# Altium schematic sheet ArduinoV1Sch.SchDoc (part 3 of 3)
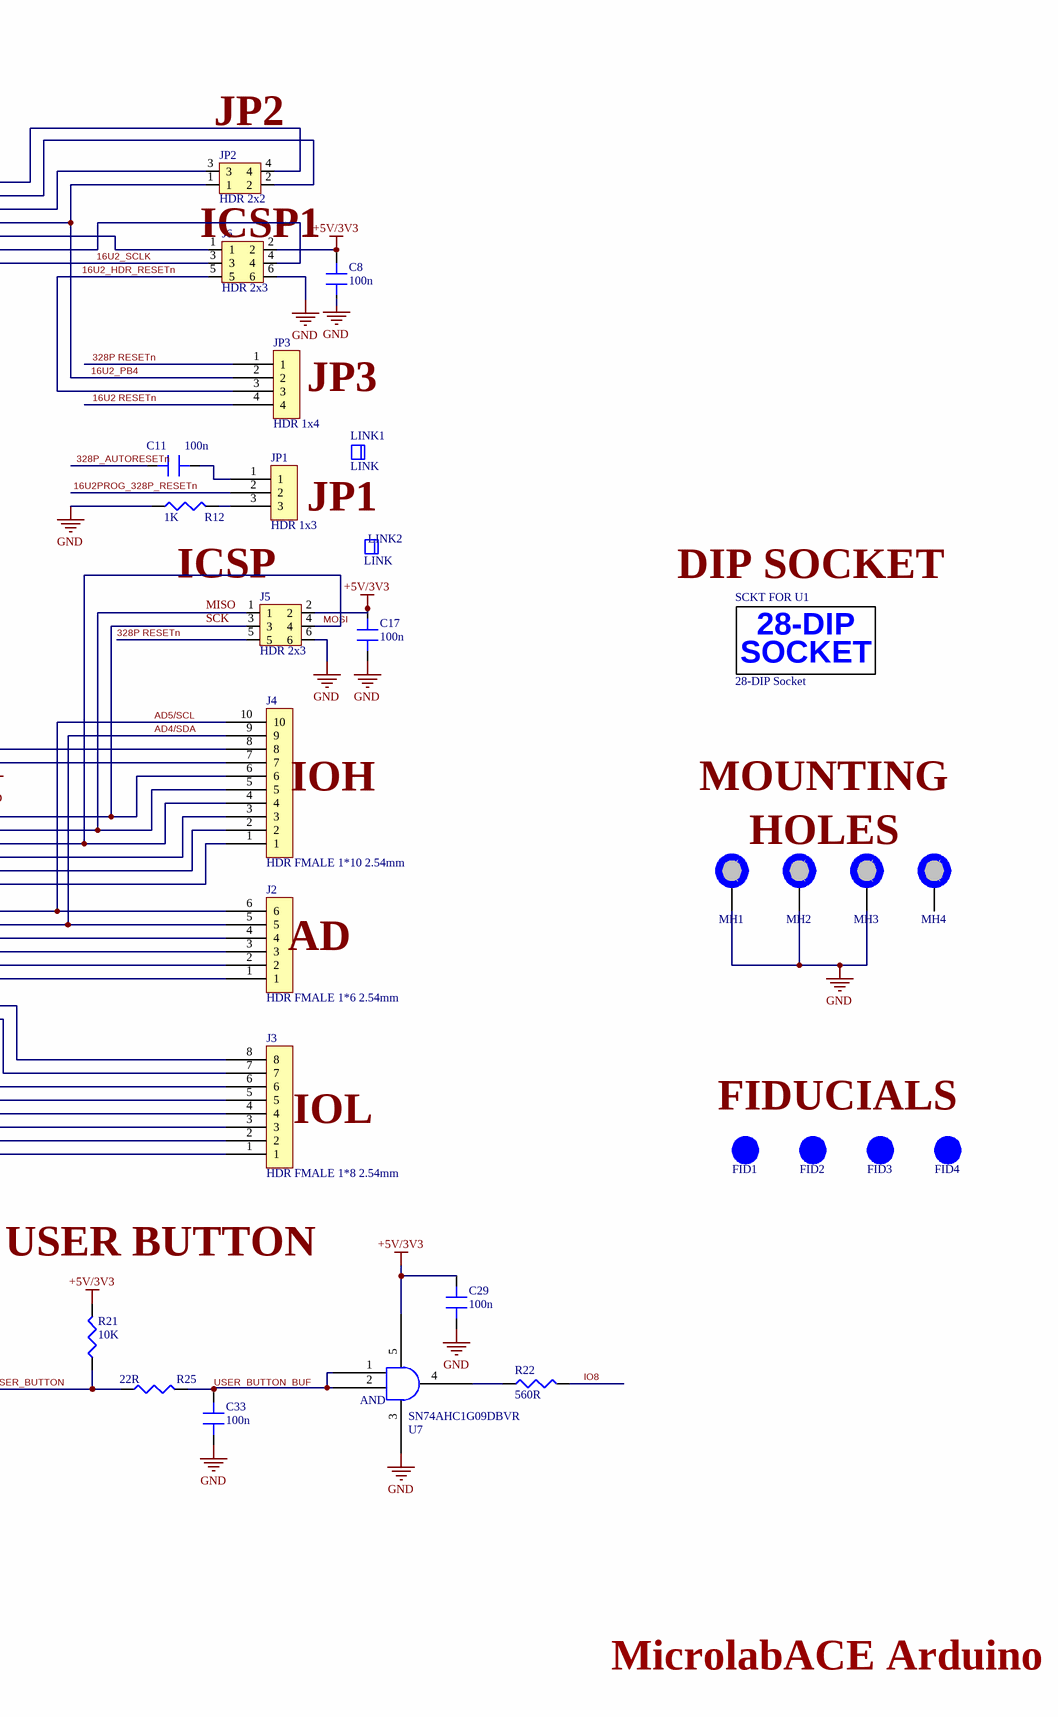
[diagram p3: ArduinoV1Sch.SchDoc, right]

## Library data of the parts (continued)
Y1 Y2 = ABM7-16.000MHZ-D2Y-T: CRYSTAL 16.0000MHZ 18PF SMD; Manufacturer: Abracon; Frequency Tolerance: 20ppm; ESR (Equivalent Series Resistance): 50R; Frequency: 16MHz; Frequency Stability: 30ppm; Supplier 1: Digi-Key; Manufacturer Part Number: ABM7-16.000MHZ-D2Y-T; Stock 1: 115067; Pricing 1: 1=0.8, 10=0.708, 50=0.6622, 100=0.5852, 500=0.5544 (USD); Mount: Surface Mount; Case/Package: CSMD; Number of Pins: 2; Min Operating Temperature: -40°C; Max Operating Temperature: 85°C; Load Capacitance: 18pF; Package Quantity: 1000; Tolerance: 20ppm; Packaging: Tape and Reel; Termination: SMD/SMT; Composition: Ceramic; Length: 6mm; Height: 0.055inch; Width: 3.3mm; Depth: 3.5mm; Radiation Hardening: No; REACH SVHC: Unknown; Lead Free: Lead Free; ComponentLink1URL: https://www.verical.com/server-webapp/html/getDatasheet?partID=721624&src-supplier=Verical; ComponentLink1Description: https://www.verical.com/server-webapp/html/getDatasheet?partID=721624&src-supplier=Verical; ComponentLink2URL: http://www.farnell.com/datasheets/947971.pdf?src-supplier=Element14; ComponentLink2Description: http://www.farnell.com/datasheets/947971.pdf?src-supplier=Element14; ComponentLink3URL: http://www.abracon.com/Resonators/abm7.pdf?src-supplier=Farnell; ComponentLink3Description: http://www.abracon.com/Resonators/abm7.pdf?src-supplier=Farnell; ComponentLink4URL: http://www.abracon.com/Resonators/abm7.pdf?src-supplier=Future+Electronics; ComponentLink4Description: http://www.abracon.com/Resonators/abm7.pdf?src-supplier=Future+Electronics; ComponentLink5URL: https://abracon.com/Resonators/abm7.pdf?src-supplier=Digi-Key; ComponentLink5Description: https://abracon.com/Resonators/abm7.pdf?src-supplier=Digi-Key; ComponentLink6URL: http://www.abracon.com/Support/PackageDrawing/Resonators/ABM7.PDF?src-supplier=Verical; ComponentLink6Description: http://www.abracon.com/Support/PackageDrawing/Resonators/ABM7.PDF?src-supplier=Verical; Supplier Part Number 1: 535-9840-6-ND
Z1 Z2 = CG0603MLC-05E: VARISTOR 0603; Manufacturer: Bourns; Capacitance: 0.5pF; Voltage Rating (DC): 5V; Number of Channels: 1; Clamping Voltage: 20V; Current Rating: 50nA; Voltage Rating (AC): 8V; Turn-On Delay Time: 1ns; Element Configuration: Single; Supplier 1: Digi-Key; Manufacturer Part Number: CG0603MLC-05E; Stock 1: 176812; Pricing 1: 1=0.51, 10=0.359, 25=0.2944, 100=0.2357, 250=0.1714, 500=0.13926, 1000=0.10712, 2500=0.09641 (USD); Case/Package: 0603; Number of Pins: 2; Case Code (Imperial): 0603; Case Code (Metric): 1608; Contact Plating: Tin; Min Operating Temperature: -40°C; Max Operating Temperature: 85°C; Operating Supply Voltage: 5V; Package Quantity: 1; Packaging: Tape and Reel; Termination: SMD/SMT; Voltage: 5V; Number of Circuits: 1; Max Voltage Rating (DC): 5V; Working Voltage: 5V; Leakage Current: 50nA; Length: 1.6mm; Width: 0.8mm; Depth: 0.8mm; Thickness: 0.8mm; Radiation Hardening: No; REACH SVHC: No SVHC; ComponentLink1URL: https://www.bourns.com/docs/Product-Datasheets/MLC.pdf?src-supplier=Digi-Key; ComponentLink1Description: https://www.bourns.com/docs/Product-Datasheets/MLC.pdf?src-supplier=Digi-Key; ComponentLink2URL: http://www.farnell.com/datasheets/1785244.pdf?src-supplier=Element14; ComponentLink2Description: http://www.farnell.com/datasheets/1785244.pdf?src-supplier=Element14; ComponentLink3URL: http://www.jameco.com/Jameco/Products/ProdDS/1163231.pdf?src-supplier=Jameco; ComponentLink3Description: http://www.jameco.com/Jameco/Products/ProdDS/1163231.pdf?src-supplier=Jameco; ComponentLink4URL: http://www.bourns.com/docs/Product-Datasheets/MLC.pdf?src-supplier=Avnet+Europe; ComponentLink4Description: http://www.bourns.com/docs/Product-Datasheets/MLC.pdf?src-supplier=Avnet+Europe; ComponentLink5URL: http://www.bourns.com/docs/Product-Datasheets/MLC.pdf?src-supplier=Avnet; ComponentLink5Description: http://www.bourns.com/docs/Product-Datasheets/MLC.pdf?src-supplier=Avnet; Supplier Part Number 1: CG0603MLC-05EDKR-ND